# EasyEDA schematic keyboard.json

## Sheets
1 矩阵: TITLE: Sheet_1; REV: 1.0; Date: 2020-11-11; Sheet: 1/1; Drawn By: key1; Company: Your Company
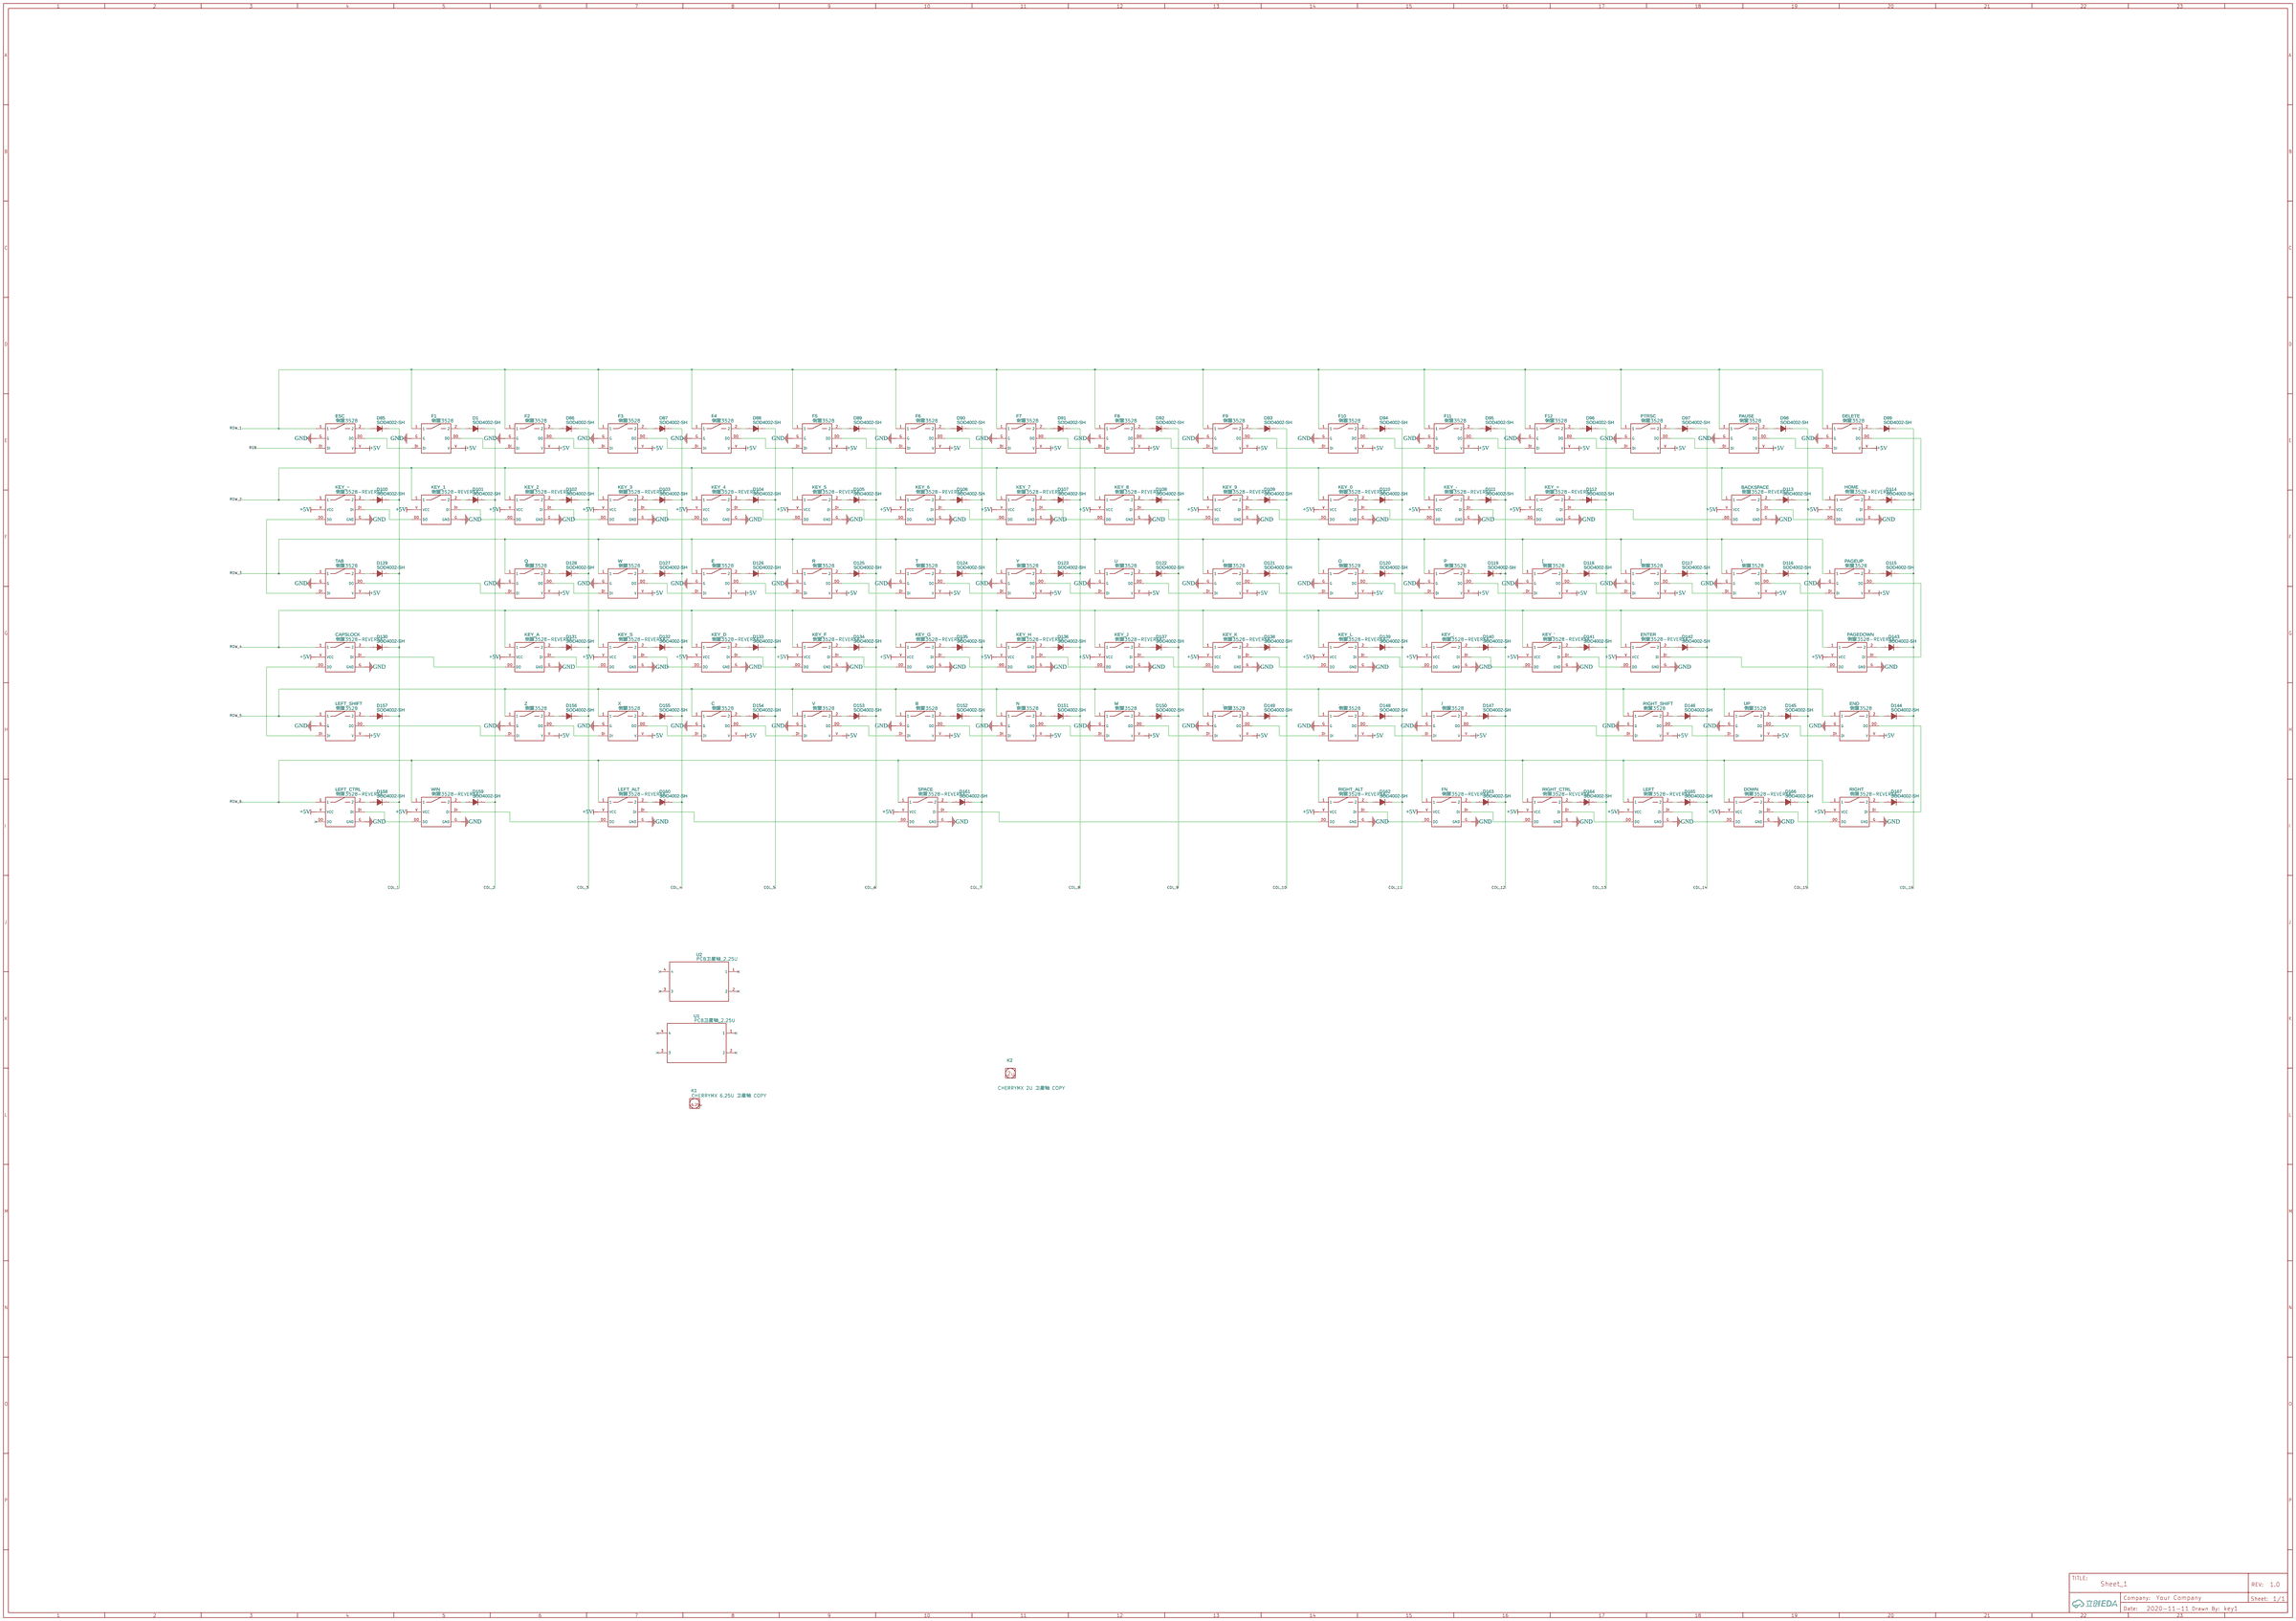
[diagram p0: 矩阵]
2 主控: TITLE: 主控
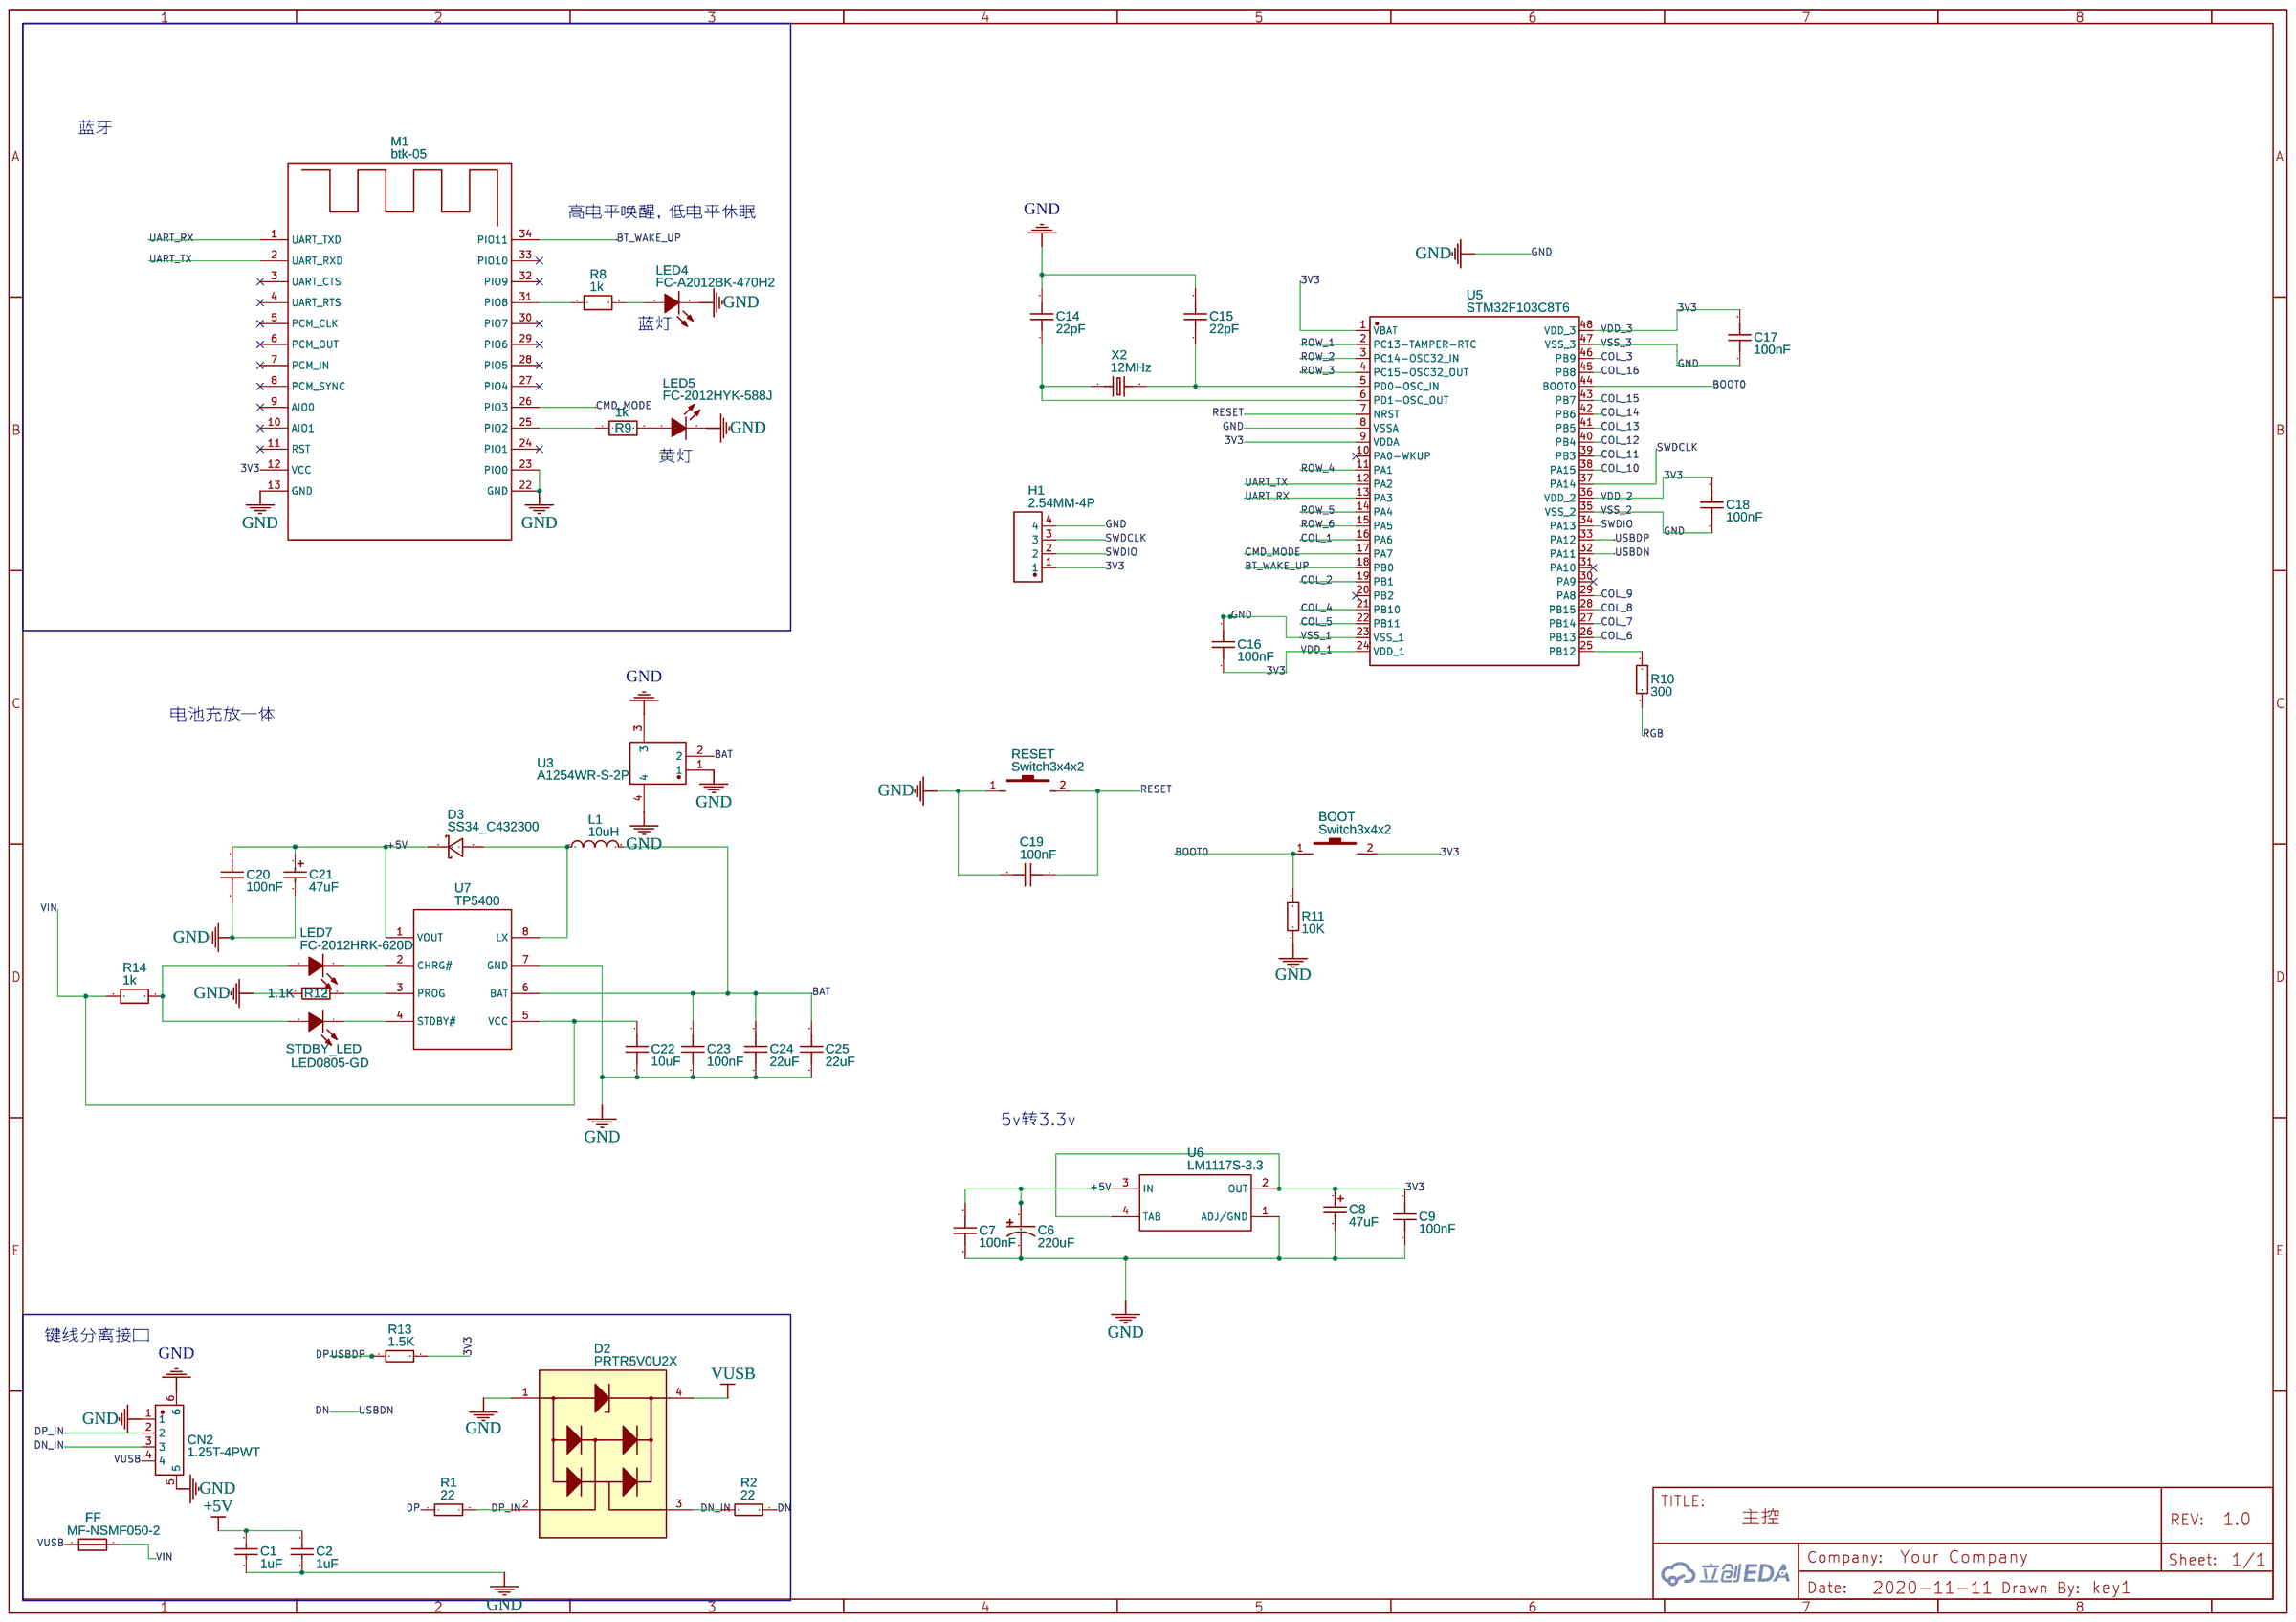
[diagram p1: 主控]

## Parts
sheet 主控
BOOT  Switch3x4x2  [KEY-3.0*4.0]
C1  1uF  [C0603]
C2  1uF  [C0603]
C6  220uF  [CAP-SMD_BD8.0-L8.3-W8.3-FD]
C7  100nF  [C0603]
C8  47uF  [CAP-SMD_L3.5-W2.8-R-RD]
C9  100nF  [C0603]
C14  22pF  [C0805]
C15  22pF  [C0805]
C16  100nF  [C0603]
C17  100nF  [C0603]
C18  100nF  [C0603]
C19  100nF  [C0603]
C20  100nF  [C0603]
C21  47uF  [CAP-SMD_L3.5-W2.8-R-RD]
C22  10uF  [C0805]
C23  100nF  [C0603]
C24  22uF  [C1206]
C25  22uF  [C1206]
CN2  1.25T-4PWT  [CONN-SMD_4P-P1.25_1.25T-4PWT]
D2  PRTR5V0U2X  [SOT-143_L2.9-W1.3-P1.92-LS2.3-BL]
D3  SS34_C432300  [SMA_L4.4-W2.8-LS5.4-RD]
FF  MF-NSMF050-2  [F1206]
H1  2.54MM-4P  [HDR-TH_4P-P2.54-V]
L1  10uH  [IND-SMD_L4.6-W4.1]
LED4  FC-A2012BK-470H2  [LED0805-RD]
LED5  FC-2012HYK-588J  [LED0805-FD]
LED7  FC-2012HRK-620D  [LED0805-RD]
M1  btk-05  [BTK-05-BLUTEETH]
R1  22  [R0603]
R2  22  [R0603]
R8  1k  [R0805]
R9  1k  [R0805]
R10  300  [R0805]
R11  10K  [R0805]
R12  1.1K  [R0805]
R13  1.5K  [R0805]
R14  1k  [R0805]
RESET  Switch3x4x2  [KEY-3.0*4.0]
STDBY_LED  LED0805-GD  [LED0805-RD]
U3  A1254WR-S-2P  [CONN-SMD_A1254WR-S-2P]
U5  STM32F103C8T6  [LQFP-48_L7.0-W7.0-P0.50-LS9.0-BL]
U6  LM1117S-3.3  [SOT-223-3_L6.5-W3.4-P2.30-LS7.0-BR]
U7  TP5400  [SOIC-8_L5.0-W4.0-P1.27-LS6.0-BL-EP]
X2  12MHz  [HC-49S_L11.4-W4.8]
sheet 矩阵
,  倒置3528  [3528热插拔灯倒置-NEW]
.  倒置3528  [3528热插拔灯倒置-NEW]
/  倒置3528  [3528热插拔灯倒置-NEW]
[  倒置3528  [3528热插拔灯倒置-NEW]
\  倒置3528  [3528热插拔灯倒置-NEW]
]  倒置3528  [3528热插拔灯倒置-NEW]
B  倒置3528  [3528热插拔灯倒置-NEW]
BACKSPACE  倒置3528-REVERSE  [3528热插拔灯倒置]
C  倒置3528  [3528热插拔灯倒置-NEW]
CAPSLOCK  倒置3528-REVERSE  [3528热插拔灯倒置]
D1  SOD4002-SH  [SOD-123F_L2.8-W1.8-LS3.7-RD]
D85  SOD4002-SH  [SOD-123F_L2.8-W1.8-LS3.7-RD]
D86  SOD4002-SH  [SOD-123F_L2.8-W1.8-LS3.7-RD]
D87  SOD4002-SH  [SOD-123F_L2.8-W1.8-LS3.7-RD]
D88  SOD4002-SH  [SOD-123F_L2.8-W1.8-LS3.7-RD]
D89  SOD4002-SH  [SOD-123F_L2.8-W1.8-LS3.7-RD]
D90  SOD4002-SH  [SOD-123F_L2.8-W1.8-LS3.7-RD]
D91  SOD4002-SH  [SOD-123F_L2.8-W1.8-LS3.7-RD]
D92  SOD4002-SH  [SOD-123F_L2.8-W1.8-LS3.7-RD]
D93  SOD4002-SH  [SOD-123F_L2.8-W1.8-LS3.7-RD]
D94  SOD4002-SH  [SOD-123F_L2.8-W1.8-LS3.7-RD]
D95  SOD4002-SH  [SOD-123F_L2.8-W1.8-LS3.7-RD]
D96  SOD4002-SH  [SOD-123F_L2.8-W1.8-LS3.7-RD]
D97  SOD4002-SH  [SOD-123F_L2.8-W1.8-LS3.7-RD]
D98  SOD4002-SH  [SOD-123F_L2.8-W1.8-LS3.7-RD]
D99  SOD4002-SH  [SOD-123F_L2.8-W1.8-LS3.7-RD]
D100  SOD4002-SH  [SOD-123F_L2.8-W1.8-LS3.7-RD]
D101  SOD4002-SH  [SOD-123F_L2.8-W1.8-LS3.7-RD]
D102  SOD4002-SH  [SOD-123F_L2.8-W1.8-LS3.7-RD]
D103  SOD4002-SH  [SOD-123F_L2.8-W1.8-LS3.7-RD]
D104  SOD4002-SH  [SOD-123F_L2.8-W1.8-LS3.7-RD]
D105  SOD4002-SH  [SOD-123F_L2.8-W1.8-LS3.7-RD]
D106  SOD4002-SH  [SOD-123F_L2.8-W1.8-LS3.7-RD]
D107  SOD4002-SH  [SOD-123F_L2.8-W1.8-LS3.7-RD]
D108  SOD4002-SH  [SOD-123F_L2.8-W1.8-LS3.7-RD]
D109  SOD4002-SH  [SOD-123F_L2.8-W1.8-LS3.7-RD]
D110  SOD4002-SH  [SOD-123F_L2.8-W1.8-LS3.7-RD]
D111  SOD4002-SH  [SOD-123F_L2.8-W1.8-LS3.7-RD]
D112  SOD4002-SH  [SOD-123F_L2.8-W1.8-LS3.7-RD]
D113  SOD4002-SH  [SOD-123F_L2.8-W1.8-LS3.7-RD]
D114  SOD4002-SH  [SOD-123F_L2.8-W1.8-LS3.7-RD]
D115  SOD4002-SH  [SOD-123F_L2.8-W1.8-LS3.7-RD]
D116  SOD4002-SH  [SOD-123F_L2.8-W1.8-LS3.7-RD]
D117  SOD4002-SH  [SOD-123F_L2.8-W1.8-LS3.7-RD]
D118  SOD4002-SH  [SOD-123F_L2.8-W1.8-LS3.7-RD]
D119  SOD4002-SH  [SOD-123F_L2.8-W1.8-LS3.7-RD]
D120  SOD4002-SH  [SOD-123F_L2.8-W1.8-LS3.7-RD]
D121  SOD4002-SH  [SOD-123F_L2.8-W1.8-LS3.7-RD]
D122  SOD4002-SH  [SOD-123F_L2.8-W1.8-LS3.7-RD]
D123  SOD4002-SH  [SOD-123F_L2.8-W1.8-LS3.7-RD]
D124  SOD4002-SH  [SOD-123F_L2.8-W1.8-LS3.7-RD]
D125  SOD4002-SH  [SOD-123F_L2.8-W1.8-LS3.7-RD]
D126  SOD4002-SH  [SOD-123F_L2.8-W1.8-LS3.7-RD]
D127  SOD4002-SH  [SOD-123F_L2.8-W1.8-LS3.7-RD]
D128  SOD4002-SH  [SOD-123F_L2.8-W1.8-LS3.7-RD]
D129  SOD4002-SH  [SOD-123F_L2.8-W1.8-LS3.7-RD]
D130  SOD4002-SH  [SOD-123F_L2.8-W1.8-LS3.7-RD]
D131  SOD4002-SH  [SOD-123F_L2.8-W1.8-LS3.7-RD]
D132  SOD4002-SH  [SOD-123F_L2.8-W1.8-LS3.7-RD]
D133  SOD4002-SH  [SOD-123F_L2.8-W1.8-LS3.7-RD]
D134  SOD4002-SH  [SOD-123F_L2.8-W1.8-LS3.7-RD]
D135  SOD4002-SH  [SOD-123F_L2.8-W1.8-LS3.7-RD]
D136  SOD4002-SH  [SOD-123F_L2.8-W1.8-LS3.7-RD]
D137  SOD4002-SH  [SOD-123F_L2.8-W1.8-LS3.7-RD]
D138  SOD4002-SH  [SOD-123F_L2.8-W1.8-LS3.7-RD]
D139  SOD4002-SH  [SOD-123F_L2.8-W1.8-LS3.7-RD]
D140  SOD4002-SH  [SOD-123F_L2.8-W1.8-LS3.7-RD]
D141  SOD4002-SH  [SOD-123F_L2.8-W1.8-LS3.7-RD]
D142  SOD4002-SH  [SOD-123F_L2.8-W1.8-LS3.7-RD]
D143  SOD4002-SH  [SOD-123F_L2.8-W1.8-LS3.7-RD]
D144  SOD4002-SH  [SOD-123F_L2.8-W1.8-LS3.7-RD]
D145  SOD4002-SH  [SOD-123F_L2.8-W1.8-LS3.7-RD]
D146  SOD4002-SH  [SOD-123F_L2.8-W1.8-LS3.7-RD]
D147  SOD4002-SH  [SOD-123F_L2.8-W1.8-LS3.7-RD]
D148  SOD4002-SH  [SOD-123F_L2.8-W1.8-LS3.7-RD]
D149  SOD4002-SH  [SOD-123F_L2.8-W1.8-LS3.7-RD]
D150  SOD4002-SH  [SOD-123F_L2.8-W1.8-LS3.7-RD]
D151  SOD4002-SH  [SOD-123F_L2.8-W1.8-LS3.7-RD]
D152  SOD4002-SH  [SOD-123F_L2.8-W1.8-LS3.7-RD]
D153  SOD4002-SH  [SOD-123F_L2.8-W1.8-LS3.7-RD]
D154  SOD4002-SH  [SOD-123F_L2.8-W1.8-LS3.7-RD]
D155  SOD4002-SH  [SOD-123F_L2.8-W1.8-LS3.7-RD]
D156  SOD4002-SH  [SOD-123F_L2.8-W1.8-LS3.7-RD]
D157  SOD4002-SH  [SOD-123F_L2.8-W1.8-LS3.7-RD]
D158  SOD4002-SH  [SOD-123F_L2.8-W1.8-LS3.7-RD]
D159  SOD4002-SH  [SOD-123F_L2.8-W1.8-LS3.7-RD]
D160  SOD4002-SH  [SOD-123F_L2.8-W1.8-LS3.7-RD]
D161  SOD4002-SH  [SOD-123F_L2.8-W1.8-LS3.7-RD]
D162  SOD4002-SH  [SOD-123F_L2.8-W1.8-LS3.7-RD]
D163  SOD4002-SH  [SOD-123F_L2.8-W1.8-LS3.7-RD]
D164  SOD4002-SH  [SOD-123F_L2.8-W1.8-LS3.7-RD]
D165  SOD4002-SH  [SOD-123F_L2.8-W1.8-LS3.7-RD]
D166  SOD4002-SH  [SOD-123F_L2.8-W1.8-LS3.7-RD]
D167  SOD4002-SH  [SOD-123F_L2.8-W1.8-LS3.7-RD]
DELETE  倒置3528  [3528热插拔灯倒置-NEW]
DOWN  倒置3528-REVERSE  [3528热插拔灯倒置]
E  倒置3528  [3528热插拔灯倒置-NEW]
END  倒置3528  [3528热插拔灯倒置-NEW]
ENTER  倒置3528-REVERSE  [3528热插拔灯倒置]
ESC  倒置3528  [3528热插拔灯倒置-NEW]
F1  倒置3528  [3528热插拔灯倒置-NEW]
F2  倒置3528  [3528热插拔灯倒置-NEW]
F3  倒置3528  [3528热插拔灯倒置-NEW]
F4  倒置3528  [3528热插拔灯倒置-NEW]
F5  倒置3528  [3528热插拔灯倒置-NEW]
F6  倒置3528  [3528热插拔灯倒置-NEW]
F7  倒置3528  [3528热插拔灯倒置-NEW]
F8  倒置3528  [3528热插拔灯倒置-NEW]
F9  倒置3528  [3528热插拔灯倒置-NEW]
F10  倒置3528  [3528热插拔灯倒置-NEW]
F11  倒置3528  [3528热插拔灯倒置-NEW]
F12  倒置3528  [3528热插拔灯倒置-NEW]
FN  倒置3528-REVERSE  [3528热插拔灯倒置]
HOME  倒置3528-REVERSE  [3528热插拔灯倒置]
I  倒置3528  [3528热插拔灯倒置-NEW]
K1  CHERRYMX 6.25U 卫星轴 COPY  [CHERRY_MX_6.25]
K2  CHERRYMX 2U 卫星轴 COPY  [CHERRY_MX_2U_卫星轴]
KEY_0  倒置3528-REVERSE  [3528热插拔灯倒置]
KEY_1  倒置3528-REVERSE  [3528热插拔灯倒置]
KEY_2  倒置3528-REVERSE  [3528热插拔灯倒置]
KEY_3  倒置3528-REVERSE  [3528热插拔灯倒置]
KEY_4  倒置3528-REVERSE  [3528热插拔灯倒置]
KEY_5  倒置3528-REVERSE  [3528热插拔灯倒置]
KEY_6  倒置3528-REVERSE  [3528热插拔灯倒置]
KEY_7  倒置3528-REVERSE  [3528热插拔灯倒置]
KEY_8  倒置3528-REVERSE  [3528热插拔灯倒置]
KEY_9  倒置3528-REVERSE  [3528热插拔灯倒置]
KEY_&#126;  倒置3528-REVERSE  [3528热插拔灯倒置]
KEY_'  倒置3528-REVERSE  [3528热插拔灯倒置]
KEY_-  倒置3528-REVERSE  [3528热插拔灯倒置]
KEY_;  倒置3528-REVERSE  [3528热插拔灯倒置]
KEY_=  倒置3528-REVERSE  [3528热插拔灯倒置]
KEY_A  倒置3528-REVERSE  [3528热插拔灯倒置]
KEY_D  倒置3528-REVERSE  [3528热插拔灯倒置]
KEY_F  倒置3528-REVERSE  [3528热插拔灯倒置]
KEY_G  倒置3528-REVERSE  [3528热插拔灯倒置]
KEY_H  倒置3528-REVERSE  [3528热插拔灯倒置]
KEY_J  倒置3528-REVERSE  [3528热插拔灯倒置]
KEY_K  倒置3528-REVERSE  [3528热插拔灯倒置]
KEY_L  倒置3528-REVERSE  [3528热插拔灯倒置]
KEY_S  倒置3528-REVERSE  [3528热插拔灯倒置]
KEY_~  倒置3528-REVERSE
LEFT  倒置3528-REVERSE  [3528热插拔灯倒置]
LEFT_ALT  倒置3528-REVERSE  [3528热插拔灯倒置]
LEFT_CTRL  倒置3528-REVERSE  [3528热插拔灯倒置]
LEFT_SHIFT  倒置3528  [3528热插拔灯倒置-NEW]
M  倒置3528  [3528热插拔灯倒置-NEW]
N  倒置3528  [3528热插拔灯倒置-NEW]
O  倒置3528  [3528热插拔灯倒置-NEW]
P  倒置3528  [3528热插拔灯倒置-NEW]
PAGEDOWN  倒置3528-REVERSE  [3528热插拔灯倒置]
PAGEUP  倒置3528  [3528热插拔灯倒置-NEW]
PAUSE  倒置3528  [3528热插拔灯倒置-NEW]
PTRSC  倒置3528  [3528热插拔灯倒置-NEW]
Q  倒置3528  [3528热插拔灯倒置-NEW]
R  倒置3528  [3528热插拔灯倒置-NEW]
RIGHT  倒置3528-REVERSE  [3528热插拔灯倒置]
RIGHT_ALT  倒置3528-REVERSE  [3528热插拔灯倒置]
RIGHT_CTRL  倒置3528-REVERSE  [3528热插拔灯倒置]
RIGHT_SHIFT  倒置3528  [3528热插拔灯倒置-NEW]
SPACE  倒置3528-REVERSE  [3528热插拔灯倒置]
T  倒置3528  [3528热插拔灯倒置-NEW]
TAB  倒置3528  [3528热插拔灯倒置-NEW]
U  倒置3528  [3528热插拔灯倒置-NEW]
U1  PCB卫星轴_2.25U  [PCB卫星轴__2.25U]
U2  PCB卫星轴_2.25U  [PCB卫星轴__2.25U]
UP  倒置3528  [3528热插拔灯倒置-NEW]
V  倒置3528  [3528热插拔灯倒置-NEW]
W  倒置3528  [3528热插拔灯倒置-NEW]
WIN  倒置3528-REVERSE  [3528热插拔灯倒置]
X  倒置3528  [3528热插拔灯倒置-NEW]
Y  倒置3528  [3528热插拔灯倒置-NEW]
Z  倒置3528  [3528热插拔灯倒置-NEW]

## Library data of the parts
BOOT RESET = Switch3x4x2: Supplier: LCSC; Manufacturer: ReliaPro; Supplier Part: C26638
C1 C2 = CL10A105KB8NNNC: Supplier: LCSC; Manufacturer: SAMSUNG; LCSC Assembly: Yes; Supplier Part: C15849; SMT Type: Basic
C6 = RVT1C221M0806: Supplier: LCSC; Manufacturer: HONOR; Supplier Part: C86608
C7 C9 C16-C18 C20 = GRM188R11C104KA01D: Supplier: LCSC; Manufacturer: MuRata; Supplier Part: C86004
C8 C21 = CA45-B-10V-47UF-K: Supplier: LCSC; Manufacturer: CEC; Supplier Part: C136658; LCSC Assembly: Yes; SMT Type: Extend
C14 C15 = 0805C-22PF: Supplier: LCSC; Manufacturer: FH; Manufacturer Part: 0805CG220J500NT; Supplier Part: C24658
C19 C23 = CT41-0603-2F4-50V-0.1UF-M(N): Supplier: LCSC; Supplier Part: C138344; Manufacturer: TORCH; Manufacturer Part: CT41-0603-2F4-50V-0.1uF-M(N); Contributor: LCSC
C22 = 0805X106K100NT: Supplier: LCSC; Manufacturer: FH; Supplier Part: C90543
C24 C25 = CL31A226KOHNNNE: Supplier: LCSC; Manufacturer: SAMSUNG; Supplier Part: C90146; LCSC Assembly: Yes; SMT Type: Extend
CN2 = 1.25T-4PWT: Supplier: LCSC; Manufacturer: BOOMELE; Supplier Part: C31597
D2 = PRTR5V0U2X: Supplier: LCSC; Supplier Part: C330092; Manufacturer: Yenji Elec; Contributor: LCSC
D3 = SS34_C432300: Supplier: LCSC; Supplier Part: C432300; Manufacturer: LGE; Manufacturer Part: SS34; Contributor: LCSC; LCSC Assembly: Yes; SMT Type: Extend
FF = MF-NSMF050-2: Supplier: LCSC; Manufacturer: BOURNS; Supplier Part: C75464; LCSC Assembly: Yes; SMT Type: Extend
H1 = 2.54MM-4P: Supplier: LCSC; Supplier Part: C390680; Manufacturer: PINREX; Manufacturer Part: 210-91-04GB01; Contributor: hai98
L1 = MHCI04020-100M-R8: Supplier: LCSC; Supplier Part: C285744; Manufacturer: Chilisin Elec; Contributor: LCSC
LED4 = FC-A2012BK-470H2: Supplier: LCSC; Manufacturer: NATIONSTAR; Supplier Part: C84259; LCSC Assembly: Yes; SMT Type: Extend; Contributor: xf345
LED5 = FC-2012HYK-588J: Supplier: LCSC; Manufacturer: NATIONSTAR; Supplier Part: C84261; LCSC Assembly: Yes; SMT Type: Extend; Contributor: xf345
LED7 = FC-2012HRK-620D: Supplier: LCSC; Manufacturer: NATIONSTAR; image: //image.lceda.cn/szlcsc/C84256.jpg; Supplier Part: C84256; LCSC Assembly: Yes; SMT Type: Basic; Contributor: xf345
M1 = btk-05: sourceId: LXR9rJ0Uc; Contributor: zqzzqz
R1 R2 = 0603WAF220JT5E: Supplier: LCSC; Manufacturer: UniOhm; LCSC Assembly: Yes; Supplier Part: C23345; SMT Type: Basic
R8 R9 R14 = R_0201_EU: Contributor: ZXT233
R10 = RMCF0805JT300R: Supplier: LCSC; Supplier Part: C237136; Manufacturer: Stackpole Elec; Contributor: LCSC
R11 = TR0805B10KP0525: Supplier: LCSC; Supplier Part: C188360; Manufacturer: Ever Ohms Tech; Contributor: LCSC
R12 = 0805W8J0112T5E: Supplier: LCSC; Supplier Part: C246845; Manufacturer: Uniroyal Elec; Contributor: LCSC
R13 = 0805W8F1501T5E: Supplier: LCSC; Manufacturer: UniOhm; LCSC Assembly: Yes; Supplier Part: C4310; SMT Type: Basic
STDBY_LED = LED0805-GD: Supplier: LCSC; Manufacturer: ARKLED; Contributor: xf345; Supplier Part: C107402; LCSC Assembly: Yes; SMT Type: Extend
U3 = A1254WR-S-2P: Supplier: LCSC; Supplier Part: C272975; Manufacturer: Changjiang Connectors; Contributor: LCSC
U5 = STM32F103C8T6: Supplier: LCSC; Manufacturer: STMicroelectronics; LCSC Assembly: Yes; image: //image.lceda.cn/szlcsc/C8734.jpg; Supplier Part: C8734; SMT Type: Basic
U6 = LM1117S-3.3: Supplier: LCSC; Manufacturer: HTC; Supplier Part: C126027; LCSC Assembly: Yes; SMT Type: Extend
U7 = TP5400: Supplier: LCSC; Manufacturer: TOPPOWER; image: //image.lceda.cn/szlcsc/C24154.jpg; Supplier Part: C24154; LCSC Assembly: Yes; SMT Type: Extend
X2 = XJHCELNANF-12MHZ: Supplier: LCSC; Supplier Part: C295091; Manufacturer: TAITIEN Elec; Contributor: LCSC
, . / [ \ ] B DELETE E END ESC F1-F12 I LEFT_SHIFT M N O P PAGEUP PAUSE PTRSC Q R RIGHT_SHIFT T TAB U UP V W X Y Z = 倒置3528: Manufacturer Part: CherryMX; Contributor: tongzhenwei2018
BACKSPACE CAPSLOCK DOWN ENTER FN HOME KEY_0-KEY_9 KEY_&#126; KEY_' KEY_- KEY_; KEY_= KEY_A KEY_D KEY_F KEY_G KEY_H KEY_J KEY_K KEY_L KEY_S LEFT LEFT_ALT LEFT_CTRL PAGEDOWN RIGHT RIGHT_ALT RIGHT_CTRL SPACE WIN = 倒置3528-REVERSE: Manufacturer Part: CherryMX; Contributor: key1
C = 倒置3528: Manufacturer Part: CherryMX; Contributor: tongzhenwei2018; Package Display: No
D1 D85-D167 = SOD4002-SH: Supplier: LCSC; Manufacturer: LRC; Contributor: LCSC; Supplier Part: C154996; LCSC Assembly: Yes; SMT Type: Extend
K1 = CHERRYMX 6.25U 卫星轴 COPY: Manufacturer Part: CherryMX; Contributor: qxs.c
K2 = CHERRYMX 2U 卫星轴 COPY: Manufacturer Part: Cherry MX; Contributor: qxs.c
KEY_~ = 倒置3528-REVERSE_38: BOM_Manufacturer Part: CherryMX
U1 U2 = PCB卫星轴_2.25U: Contributor: HaiMianzzZ

## Nets
3V3: BOOT.2 C8.1 C9.2 C16.1 C17.2 C18.2 H1.1 M1.12(VCC) R13.2 U5.1(VBAT) U5.9(VDDA) U5.24(VDD_1) U5.36(VDD_2) U5.48(VDD_3) U6.2(OUT) U6.4(TAB)
+5V: ,.V ..V /.V [.V \.V ].V B.V BACKSPACE.V(VCC) C.V C1.2 C2.2 C6.1 C7.2 C20.2 C21.1 CAPSLOCK.V(VCC) D3.1(C) DELETE.V DOWN.V(VCC) E.V END.V ENTER.V(VCC) ESC.V F1.V F2.V F3.V F4.V F5.V F6.V F7.V F8.V F9.V F10.V F11.V F12.V FN.V(VCC) HOME.V(VCC) I.V KEY_0.V(VCC) KEY_1.V(VCC) KEY_2.V(VCC) KEY_3.V(VCC) KEY_4.V(VCC) KEY_5.V(VCC) KEY_6.V(VCC) KEY_7.V(VCC) KEY_8.V(VCC) KEY_9.V(VCC) KEY_&#126;.V(VCC) KEY_'.V(VCC) KEY_-.V(VCC) KEY_;.V(VCC) KEY_=.V(VCC) KEY_A.V(VCC) KEY_D.V(VCC) KEY_F.V(VCC) KEY_G.V(VCC) KEY_H.V(VCC) KEY_J.V(VCC) KEY_K.V(VCC) KEY_L.V(VCC) KEY_S.V(VCC) LEFT.V(VCC) LEFT_ALT.V(VCC) LEFT_CTRL.V(VCC) LEFT_SHIFT.V M.V N.V O.V P.V PAGEDOWN.V(VCC) PAGEUP.V PAUSE.V PTRSC.V Q.V R.V RIGHT.V(VCC) RIGHT_ALT.V(VCC) RIGHT_CTRL.V(VCC) RIGHT_SHIFT.V SPACE.V(VCC) T.V TAB.V U.V U6.3(IN) U7.1(VOUT) UP.V V.V W.V WIN.V(VCC) X.V Y.V Z.V
GND: ,.G ..G /.G [.G \.G ].G B.G BACKSPACE.G(GND) C.G C1.1 C2.1 C6.2 C7.1 C8.2 C9.1 C14.2 C15.2 C16.2 C17.1 C18.1 C19.2 C20.1 C21.2 C22.1 C23.2 C24.1 C25.1 CAPSLOCK.G(GND) CN2.1 CN2.5 CN2.6 D2.1(GND) DELETE.G DOWN.G(GND) E.G END.G ENTER.G(GND) ESC.G F1.G F2.G F3.G F4.G F5.G F6.G F7.G F8.G F9.G F10.G F11.G F12.G FN.G(GND) H1.4 HOME.G(GND) I.G KEY_0.G(GND) KEY_1.G(GND) KEY_2.G(GND) KEY_3.G(GND) KEY_4.G(GND) KEY_5.G(GND) KEY_6.G(GND) KEY_7.G(GND) KEY_8.G(GND) KEY_9.G(GND) KEY_&#126;.G(GND) KEY_'.G(GND) KEY_-.G(GND) KEY_;.G(GND) KEY_=.G(GND) KEY_A.G(GND) KEY_D.G(GND) KEY_F.G(GND) KEY_G.G(GND) KEY_H.G(GND) KEY_J.G(GND) KEY_K.G(GND) KEY_L.G(GND) KEY_S.G(GND) LED4.1(-) LED5.2(K) LEFT.G(GND) LEFT_ALT.G(GND) LEFT_CTRL.G(GND) LEFT_SHIFT.G M.G M1.13(GND) M1.22(GND) M1.23(PIO0) N.G O.G P.G PAGEDOWN.G(GND) PAGEUP.G PAUSE.G PTRSC.G Q.G R.G R11.1 R12.1 RESET.1 RIGHT.G(GND) RIGHT_ALT.G(GND) RIGHT_CTRL.G(GND) RIGHT_SHIFT.G SPACE.G(GND) T.G TAB.G U.G U3.1 U3.3 U3.4 U5.8(VSSA) U5.23(VSS_1) U5.35(VSS_2) U5.47(VSS_3) U6.1(ADJ/GND) U7.7(GND) UP.G V.G W.G WIN.G(GND) X.G Y.G Z.G
VIN: C22.2 FF.2 R14.2 U7.5(VCC)
BAT: C23.1 C24.2 C25.2 L1.2 U3.2 U7.6(BAT)
BOOT0: BOOT.1 R11.2 U5.44(BOOT0)
BT_WAKE_UP: M1.34(PIO11) U5.18(PB0)
CMD_MODE: M1.26(PIO3) U5.17(PA7)
COL_1: D85.1(K) D100.1(K) D129.1(K) D130.1(K) D157.1(K) D158.1(K) U5.16(PA6)
COL_2: D1.1(K) D101.1(K) D159.1(K) U5.19(PB1)
COL_3: D86.1(K) D102.1(K) D128.1(K) D131.1(K) D156.1(K) U5.46(PB9)
COL_4: D87.1(K) D103.1(K) D127.1(K) D132.1(K) D155.1(K) D160.1(K) U5.21(PB10)
COL_5: D88.1(K) D104.1(K) D126.1(K) D133.1(K) D154.1(K) U5.22(PB11)
COL_6: D89.1(K) D105.1(K) D125.1(K) D134.1(K) D153.1(K) U5.26(PB13)
COL_7: D90.1(K) D106.1(K) D124.1(K) D135.1(K) D152.1(K) D161.1(K) U5.27(PB14)
COL_8: D91.1(K) D107.1(K) D123.1(K) D136.1(K) D151.1(K) U5.28(PB15)
COL_9: D92.1(K) D108.1(K) D122.1(K) D137.1(K) D150.1(K) U5.29(PA8)
COL_10: D93.1(K) D109.1(K) D121.1(K) D138.1(K) D149.1(K) U5.38(PA15)
COL_11: D94.1(K) D110.1(K) D120.1(K) D139.1(K) D148.1(K) D162.1(K) U5.39(PB3)
COL_12: D95.1(K) D111.1(K) D119.1(K) D140.1(K) D147.1(K) D163.1(K) U5.40(PB4)
COL_13: D96.1(K) D112.1(K) D118.1(K) D141.1(K) D164.1(K) U5.41(PB5)
COL_14: D97.1(K) D117.1(K) D142.1(K) D146.1(K) D165.1(K) U5.42(PB6)
COL_15: D98.1(K) D113.1(K) D116.1(K) D145.1(K) D166.1(K) U5.43(PB7)
COL_16: D99.1(K) D114.1(K) D115.1(K) D143.1(K) D144.1(K) D167.1(K) U5.45(PB8)
DN: R2.2 U5.32(PA11)
DN_IN: CN2.3 D2.3(IO2) R2.1
DP: R1.1 R13.1 U5.33(PA12)
DP_IN: CN2.2 D2.2(IO1) R1.2
RESET: C19.1 RESET.2 U5.7(NRST)
RGB: ESC.DI R10.2
ROW_1: DELETE.1 ESC.1 F1.1 F2.1 F3.1 F4.1 F5.1 F6.1 F7.1 F8.1 F9.1 F10.1 F11.1 F12.1 PAUSE.1 PTRSC.1 U5.2(PC13-TAMPER-RTC)
ROW_2: BACKSPACE.1 HOME.1 KEY_0.1 KEY_1.1 KEY_2.1 KEY_3.1 KEY_4.1 KEY_5.1 KEY_6.1 KEY_7.1 KEY_8.1 KEY_9.1 KEY_&#126;.1 KEY_-.1 KEY_=.1 U5.3(PC14-OSC32_IN)
ROW_3: [.1 \.1 ].1 E.1 I.1 O.1 P.1 PAGEUP.1 Q.1 R.1 T.1 TAB.1 U.1 U5.4(PC15-OSC32_OUT) W.1 Y.1
ROW_4: CAPSLOCK.1 ENTER.1 KEY_'.1 KEY_;.1 KEY_A.1 KEY_D.1 KEY_F.1 KEY_G.1 KEY_H.1 KEY_J.1 KEY_K.1 KEY_L.1 KEY_S.1 PAGEDOWN.1 U5.11(PA1)
ROW_5: ,.1 ..1 /.1 B.1 C.1 END.1 LEFT_SHIFT.1 M.1 N.1 RIGHT_SHIFT.1 U5.14(PA4) UP.1 V.1 X.1 Z.1
ROW_6: DOWN.1 FN.1 LEFT.1 LEFT_ALT.1 LEFT_CTRL.1 RIGHT.1 RIGHT_ALT.1 RIGHT_CTRL.1 SPACE.1 U5.15(PA5) WIN.1
SWDCLK: H1.3 U5.37(PA14)
SWDIO: H1.2 U5.34(PA13)
UART_RX: M1.1(UART_TXD) U5.13(PA3)
UART_TX: M1.2(UART_RXD) U5.12(PA2)
VUSB: CN2.4 D2.4(VCC) FF.1
Net-(,-2): ,.2 D149.2(A)
Net-(,-DI): ,.DI M.DO
Net-(,-DO): ,.DO ..DI
Net-(.-2): ..2 D148.2(A)
Net-(.-DO): ..DO /.DI
Net-(/-2): /.2 D147.2(A)
Net-(/-DO): /.DO RIGHT_SHIFT.DI
Net-([-2): [.2 D118.2(A)
Net-([-DI): [.DI P.DO
Net-([-DO): [.DO ].DI
Net-(\-2): \.2 D116.2(A)
Net-(\-DI): \.DI ].DO
Net-(\-DO): \.DO PAGEUP.DI
Net-(]-2): ].2 D117.2(A)
Net-(B-2): B.2 D152.2(A)
Net-(B-DI): B.DI V.DO
Net-(B-DO): B.DO N.DI
Net-(BACKSPACE-2): BACKSPACE.2 D113.2(A)
Net-(BACKSPACE-DI): BACKSPACE.DI HOME.DO
Net-(BACKSPACE-DO): BACKSPACE.DO KEY_=.DI
Net-(C14-1): C14.1 U5.6(PD1-OSC_OUT) X2.1
Net-(C15-1): C15.1 U5.5(PD0-OSC_IN) X2.2
Net-(C-2): C.2 D154.2(A)
Net-(C-DI): C.DI X.DO
Net-(C-DO): C.DO V.DI
Net-(CAPSLOCK-2): CAPSLOCK.2 D130.2(A)
Net-(CAPSLOCK-DI): CAPSLOCK.DI KEY_A.DO
Net-(CAPSLOCK-DO): CAPSLOCK.DO LEFT_SHIFT.DI
Net-(D1-2): D1.2(A) F1.2
Net-(D3-2): D3.2(A) L1.1 U7.8(LX)
Net-(D85-2): D85.2(A) ESC.2
Net-(D86-2): D86.2(A) F2.2
Net-(D87-2): D87.2(A) F3.2
Net-(D88-2): D88.2(A) F4.2
Net-(D89-2): D89.2(A) F5.2
Net-(D90-2): D90.2(A) F6.2
Net-(D91-2): D91.2(A) F7.2
Net-(D92-2): D92.2(A) F8.2
Net-(D93-2): D93.2(A) F9.2
Net-(D94-2): D94.2(A) F10.2
Net-(D95-2): D95.2(A) F11.2
Net-(D96-2): D96.2(A) F12.2
Net-(D97-2): D97.2(A) PTRSC.2
Net-(D98-2): D98.2(A) PAUSE.2
Net-(D99-2): D99.2(A) DELETE.2
Net-(D100-2): D100.2(A) KEY_&#126;.2
Net-(D101-2): D101.2(A) KEY_1.2
Net-(D102-2): D102.2(A) KEY_2.2
Net-(D103-2): D103.2(A) KEY_3.2
Net-(D104-2): D104.2(A) KEY_4.2
Net-(D105-2): D105.2(A) KEY_5.2
Net-(D106-2): D106.2(A) KEY_6.2
Net-(D107-2): D107.2(A) KEY_7.2
Net-(D108-2): D108.2(A) KEY_8.2
Net-(D109-2): D109.2(A) KEY_9.2
Net-(D110-2): D110.2(A) KEY_0.2
Net-(D111-2): D111.2(A) KEY_-.2
Net-(D112-2): D112.2(A) KEY_=.2
Net-(D114-2): D114.2(A) HOME.2
Net-(D115-2): D115.2(A) PAGEUP.2
Net-(D119-2): D119.2(A) P.2
Net-(D120-2): D120.2(A) O.2
Net-(D121-2): D121.2(A) I.2
Net-(D122-2): D122.2(A) U.2
Net-(D123-2): D123.2(A) Y.2
Net-(D124-2): D124.2(A) T.2
Net-(D125-2): D125.2(A) R.2
Net-(D126-2): D126.2(A) E.2
Net-(D127-2): D127.2(A) W.2
Net-(D128-2): D128.2(A) Q.2
Net-(D129-2): D129.2(A) TAB.2
Net-(D131-2): D131.2(A) KEY_A.2
Net-(D132-2): D132.2(A) KEY_S.2
Net-(D133-2): D133.2(A) KEY_D.2
Net-(D134-2): D134.2(A) KEY_F.2
Net-(D135-2): D135.2(A) KEY_G.2
Net-(D136-2): D136.2(A) KEY_H.2
Net-(D137-2): D137.2(A) KEY_J.2
Net-(D138-2): D138.2(A) KEY_K.2
Net-(D139-2): D139.2(A) KEY_L.2
Net-(D140-2): D140.2(A) KEY_;.2
Net-(D141-2): D141.2(A) KEY_'.2
Net-(D142-2): D142.2(A) ENTER.2
Net-(D143-2): D143.2(A) PAGEDOWN.2
Net-(D144-2): D144.2(A) END.2
Net-(D145-2): D145.2(A) UP.2
Net-(D146-2): D146.2(A) RIGHT_SHIFT.2
Net-(D150-2): D150.2(A) M.2
Net-(D151-2): D151.2(A) N.2
Net-(D153-2): D153.2(A) V.2
Net-(D155-2): D155.2(A) X.2
Net-(D156-2): D156.2(A) Z.2
Net-(D157-2): D157.2(A) LEFT_SHIFT.2
Net-(D158-2): D158.2(A) LEFT_CTRL.2
Net-(D159-2): D159.2(A) WIN.2
Net-(D160-2): D160.2(A) LEFT_ALT.2
Net-(D161-2): D161.2(A) SPACE.2
Net-(D162-2): D162.2(A) RIGHT_ALT.2
Net-(D163-2): D163.2(A) FN.2
Net-(D164-2): D164.2(A) RIGHT_CTRL.2
Net-(D165-2): D165.2(A) LEFT.2
Net-(D166-2): D166.2(A) DOWN.2
Net-(D167-2): D167.2(A) RIGHT.2
Net-(DELETE-DI): DELETE.DI PAUSE.DO
Net-(DELETE-DO): DELETE.DO HOME.DI
Net-(DOWN-DI): DOWN.DI RIGHT.DO
Net-(DOWN-DO): DOWN.DO LEFT.DI
Net-(E-DI): E.DI W.DO
Net-(E-DO): E.DO R.DI
Net-(END-DI): END.DI UP.DO
Net-(END-DO): END.DO RIGHT.DI
Net-(ENTER-DI): ENTER.DI PAGEDOWN.DO
Net-(ENTER-DO): ENTER.DO KEY_'.DI
Net-(ESC-DO): ESC.DO F1.DI
Net-(F1-DO): F1.DO F2.DI
Net-(F2-DO): F2.DO F3.DI
Net-(F3-DO): F3.DO F4.DI
Net-(F4-DO): F4.DO F5.DI
Net-(F5-DO): F5.DO F6.DI
Net-(F6-DO): F6.DO F7.DI
Net-(F7-DO): F7.DO F8.DI
Net-(F8-DO): F8.DO F9.DI
Net-(F9-DO): F9.DO F10.DI
Net-(F10-DO): F10.DO F11.DI
Net-(F11-DO): F11.DO F12.DI
Net-(F12-DO): F12.DO PTRSC.DI
Net-(FN-DI): FN.DI RIGHT_CTRL.DO
Net-(FN-DO): FN.DO RIGHT_ALT.DI
Net-(I-DI): I.DI U.DO
Net-(I-DO): I.DO O.DI
Net-(KEY_0-DI): KEY_0.DI KEY_-.DO
Net-(KEY_0-DO): KEY_0.DO KEY_9.DI
Net-(KEY_1-DI): KEY_1.DI KEY_2.DO
Net-(KEY_1-DO): KEY_1.DO KEY_&#126;.DI
Net-(KEY_2-DI): KEY_2.DI KEY_3.DO
Net-(KEY_3-DI): KEY_3.DI KEY_4.DO
Net-(KEY_4-DI): KEY_4.DI KEY_5.DO
Net-(KEY_5-DI): KEY_5.DI KEY_6.DO
Net-(KEY_6-DI): KEY_6.DI KEY_7.DO
Net-(KEY_7-DI): KEY_7.DI KEY_8.DO
Net-(KEY_8-DI): KEY_8.DI KEY_9.DO
Net-(KEY_&#126;-DO): KEY_&#126;.DO TAB.DI
Net-(KEY_'-DO): KEY_'.DO KEY_;.DI
Net-(KEY_--DI): KEY_-.DI KEY_=.DO
Net-(KEY_;-DO): KEY_;.DO KEY_L.DI
Net-(KEY_A-DI): KEY_A.DI KEY_S.DO
Net-(KEY_D-DI): KEY_D.DI KEY_F.DO
Net-(KEY_D-DO): KEY_D.DO KEY_S.DI
Net-(KEY_F-DI): KEY_F.DI KEY_G.DO
Net-(KEY_G-DI): KEY_G.DI KEY_H.DO
Net-(KEY_H-DI): KEY_H.DI KEY_J.DO
Net-(KEY_J-DI): KEY_J.DI KEY_K.DO
Net-(KEY_K-DI): KEY_K.DI KEY_L.DO
Net-(LED4-2): LED4.2(+) R8.2
Net-(LED5-1): LED5.1(A) R9.2
Net-(LED7-1): LED7.1(-) U7.2(CHRG#)
Net-(LED7-2): LED7.2(+) R14.1 STDBY_LED.2(A)
Net-(LEFT-DO): LEFT.DO RIGHT_CTRL.DI
Net-(LEFT_ALT-DI): LEFT_ALT.DI SPACE.DO
Net-(LEFT_ALT-DO): LEFT_ALT.DO WIN.DI
Net-(LEFT_CTRL-DI): LEFT_CTRL.DI WIN.DO
Net-(LEFT_SHIFT-DO): LEFT_SHIFT.DO Z.DI
Net-(M1-25): M1.25(PIO2) R9.1
Net-(M1-31): M1.31(PIO8) R8.1
Net-(M-DI): M.DI N.DO
Net-(O-DO): O.DO P.DI
Net-(PAGEDOWN-DI): PAGEDOWN.DI PAGEUP.DO
Net-(PAUSE-DI): PAUSE.DI PTRSC.DO
Net-(Q-DI): Q.DI TAB.DO
Net-(Q-DO): Q.DO W.DI
Net-(R10-1): R10.1 U5.25(PB12)
Net-(R12-2): R12.2 U7.3(PROG)
Net-(R-DO): R.DO T.DI
Net-(RIGHT_ALT-DO): RIGHT_ALT.DO SPACE.DI
Net-(RIGHT_SHIFT-DO): RIGHT_SHIFT.DO UP.DI
Net-(STDBY_LED-1): STDBY_LED.1(K) U7.4(STDBY#)
Net-(T-DO): T.DO Y.DI
Net-(U-DI): U.DI Y.DO
Net-(X-DI): X.DI Z.DO

Not connected (* = marked no-connect by the designer): LEFT_CTRL DO*; M1 3(UART_CTS)* 4(UART_RTS)* 5(PCM_CLK)* 6(PCM_OUT)* 7(PCM_IN)* 8(PCM_SYNC)* 9(AIO0)* 10(AIO1)* 11(RST)* 24(PIO1)* 27(PIO4)* 28(PIO5)* 29(PIO6)* 30(PIO7)* 32(PIO9)* 33(PIO10)*; U1 1* 2* 3* 4*; U2 1* 2* 3* 4*; U5 10(PA0-WKUP)* 20(PB2)* 30(PA9)* 31(PA10)*

## Notes on the sheets
sheet 2
- 蓝牙
- 高电平唤醒，低电平休眠
- 蓝灯
- 黄灯
- 电池充放一体
- 5v转3.3v
- 键线分离接口
